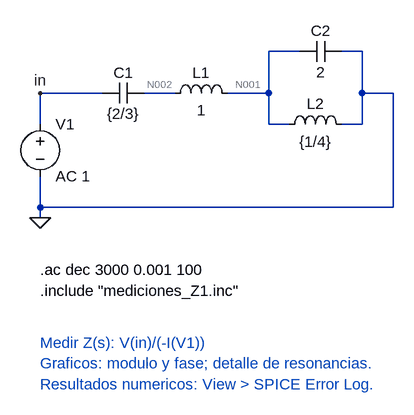
[diagram p0: schematic ejercicio1a.asc]
ejercicio1a.asc, the LTspice schematic file:
Version 4.1
SHEET 1 1000 760
WIRE 384 48 336 48
WIRE 480 48 448 48
WIRE 80 112 -16 112
WIRE 192 112 144 112
WIRE 336 112 336 48
WIRE 336 112 272 112
WIRE 480 112 480 48
WIRE 528 112 480 112
WIRE -16 160 -16 112
WIRE 336 160 336 112
WIRE 368 160 336 160
WIRE 480 160 480 112
WIRE 480 160 448 160
WIRE -16 288 -16 240
WIRE 528 288 528 112
WIRE 528 288 -16 288
WIRE -16 304 -16 288
FLAG -16 304 0
SYMBOL cap 144 96 R90
WINDOW 0 0 32 VBottom 2
WINDOW 3 32 32 VTop 2
SYMATTR InstName C1
SYMATTR Value {2/3}
SYMBOL ind 176 128 R270
WINDOW 0 32 56 VTop 2
WINDOW 3 5 56 VBottom 2
SYMATTR InstName L1
SYMATTR Value 1
SYMATTR SpiceLine Rser=0 Rpar=1e30
SYMBOL ind 352 176 R270
WINDOW 0 32 56 VTop 2
WINDOW 3 5 56 VBottom 2
SYMATTR InstName L2
SYMATTR Value {1/4}
SYMATTR SpiceLine Rser=0 Rpar=1e30
SYMBOL cap 448 32 R90
WINDOW 0 0 32 VBottom 2
WINDOW 3 32 32 VTop 2
SYMATTR InstName C2
SYMATTR Value 2
SYMBOL voltage -16 144 R0
SYMATTR InstName V1
SYMATTR Value AC 1
FLAG -16 112 in
TEXT -16 384 Left 2 !.ac dec 3000 0.001 100
TEXT -16 416 Left 2 !.include "mediciones_Z1.inc"
TEXT -16 496 Left 2 ;Medir Z(s): V(in)/(-I(V1))
TEXT -16 528 Left 2 ;Graficos: modulo y fase; detalle de resonancias.
TEXT -16 560 Left 2 ;Resultados numericos: View > SPICE Error Log.

The netlist it stands for:
* ejercicio1a.asc
C1 N002 in {2/3}
L1 N002 N001 1 Rser=0 Rpar=1e30
L2 N001 0 {1/4} Rser=0 Rpar=1e30
C2 0 N001 2
V1 in 0 AC 1
.ac dec 3000 0.001 100
.include "mediciones_Z1.inc"
* Medir Z(s): V(in)/(-I(V1))
* Graficos: modulo y fase; detalle de resonancias.
* Resultados numericos: View > SPICE Error Log.
.backanno
.end

* Results of the author's LTspice run, read from the files saved beside the schematic
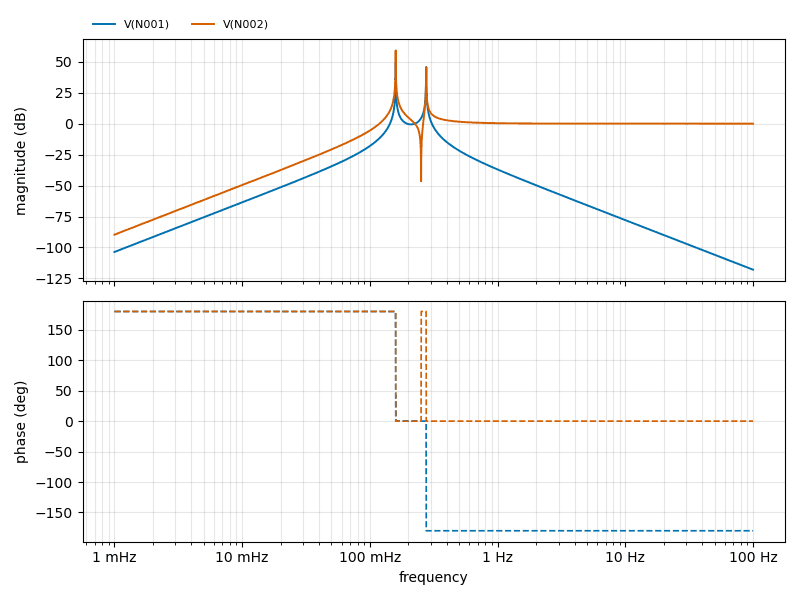
[diagram p1: AC Analysis of ejercicio1a.asc, plotted from the saved traces]
* AC Analysis, 1 run:
*   V(N001): -103.64 dB at 1 mHz, -117.95 dB at 100 Hz, peak 61.18 dB at 275.6 mHz, 3 dB below the peak at 275.6 mHz and 275.7 mHz
*   V(N002): -89.66 dB at 1 mHz, 0.00 dB at 100 Hz, peak 61.16 dB at 275.6 mHz, 3 dB below the peak at 275.6 mHz and 275.7 mHz